# EAGLE design working (EAGLE 6.3)
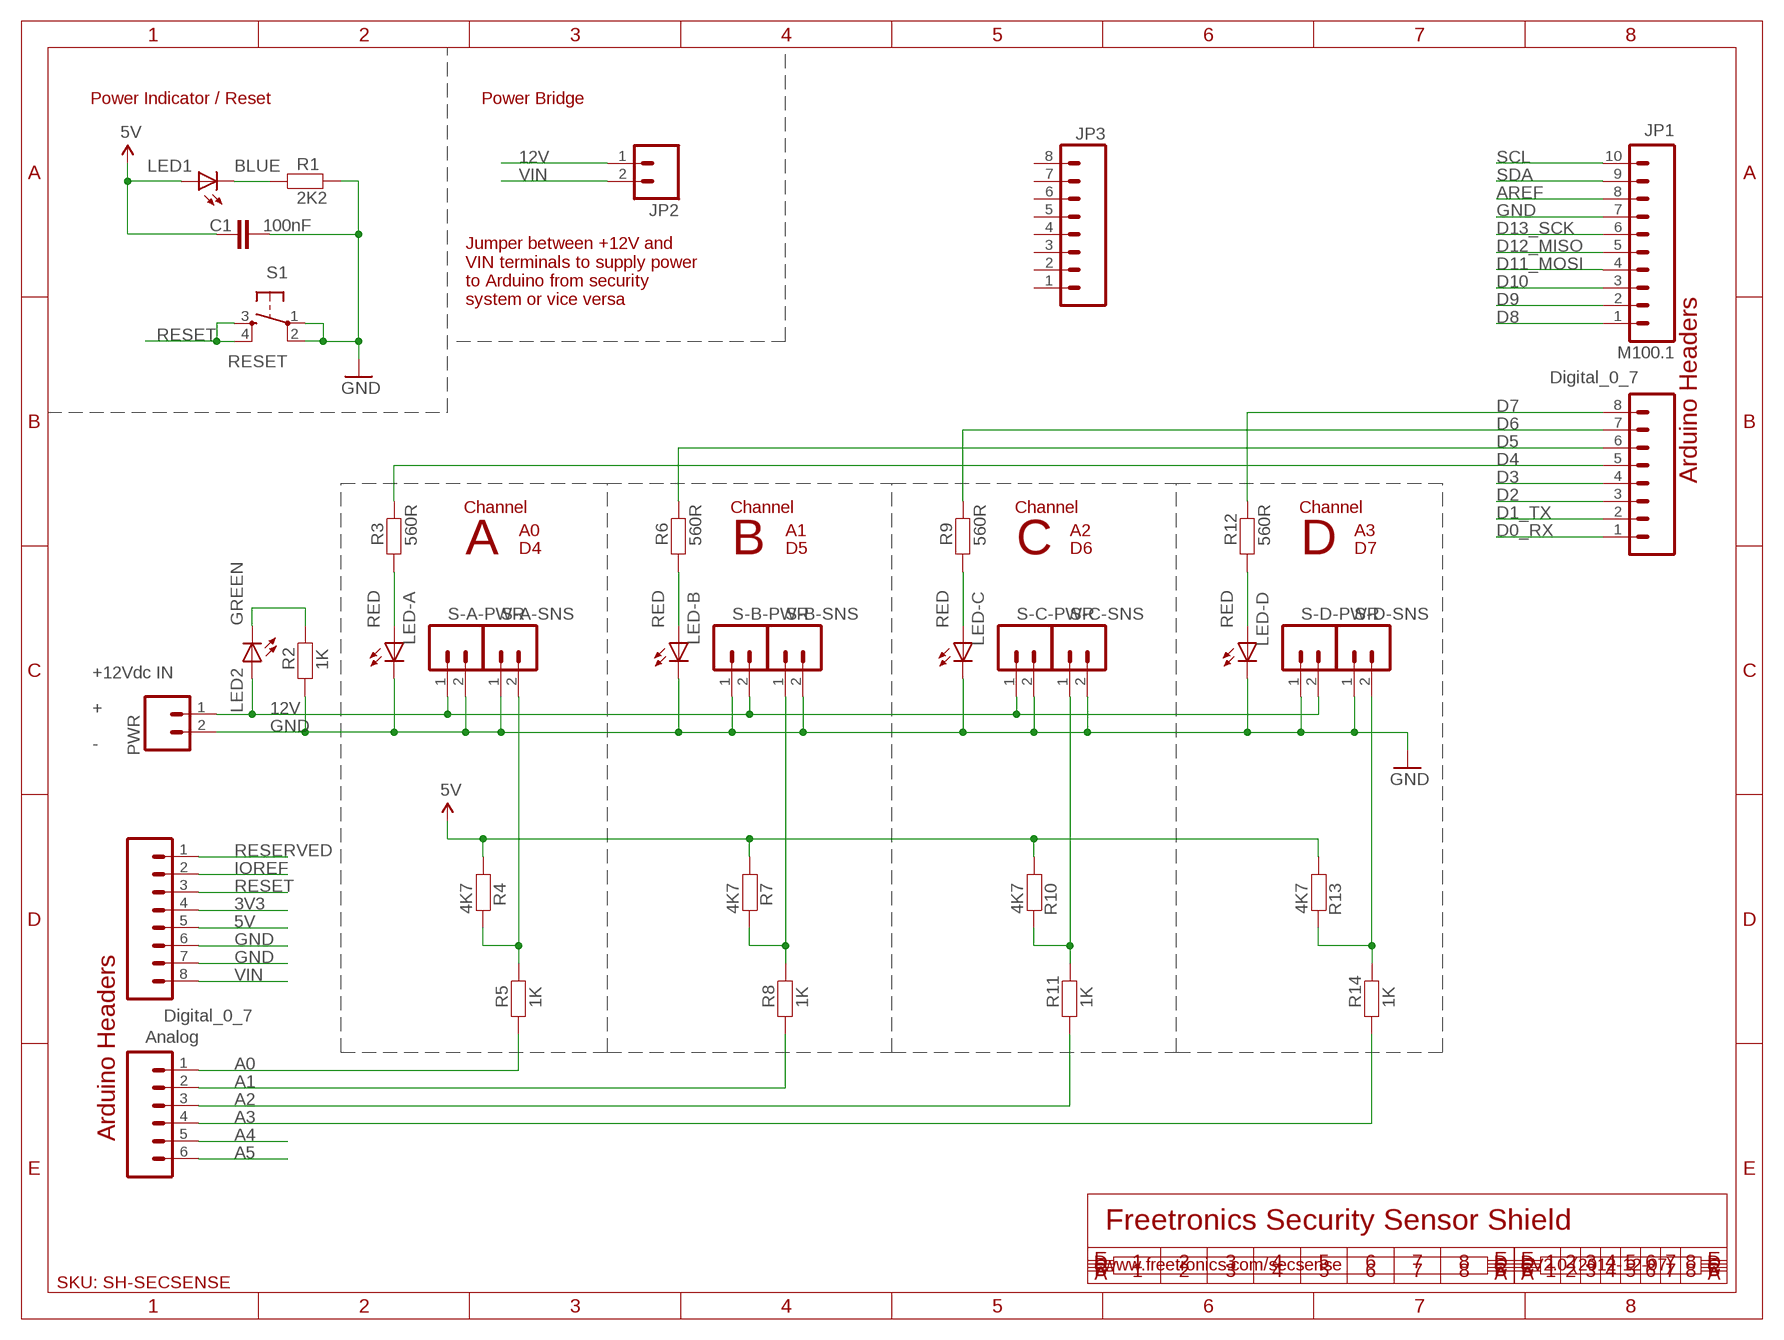
[diagram p0: schematic, sheet 1]

## Parts
C1  100nF  FREETRONICS_CAPPTH  [FREETRONICS_CAP-PTH-SMALL]
J1  Digital_0_7  M08  [1X08]
J2  Analog  M06SIP  [1X06]
J3  Digital_0_7  M08  [1X08]
JP1  M100.1  [1X10]
JP2  M02PTH  [1X02]
JP3  M08  [TERMINALBLOCK_3.5MM_8]
LED1  BLUE  LED3MM  [LED3MM]
LED2  GREEN  LED3MM  [LED3MM]
LED-A  RED  LED3MM  [LED3MM]
LED-B  RED  LED3MM  [LED3MM]
LED-C  RED  LED3MM  [LED3MM]
LED-D  RED  LED3MM  [LED3MM]
PWR  M025MM  [SCREWTERMINAL-5MM-2]
R1  2K2  FREETRONICS_RESISTORPTH2  [FREETRONICS_AXIAL-0.4]
R2  1K  FREETRONICS_RESISTORPTH2  [FREETRONICS_AXIAL-0.4]
R3  560R  FREETRONICS_RESISTORPTH2  [FREETRONICS_AXIAL-0.4]
R4  4K7  FREETRONICS_RESISTORPTH2  [FREETRONICS_AXIAL-0.4]
R5  1K  FREETRONICS_RESISTORPTH2  [FREETRONICS_AXIAL-0.4]
R6  560R  FREETRONICS_RESISTORPTH2  [FREETRONICS_AXIAL-0.4]
R7  4K7  FREETRONICS_RESISTORPTH2  [FREETRONICS_AXIAL-0.4]
R8  1K  FREETRONICS_RESISTORPTH2  [FREETRONICS_AXIAL-0.4]
R9  560R  FREETRONICS_RESISTORPTH2  [FREETRONICS_AXIAL-0.4]
R10  4K7  FREETRONICS_RESISTORPTH2  [FREETRONICS_AXIAL-0.4]
R11  1K  FREETRONICS_RESISTORPTH2  [FREETRONICS_AXIAL-0.4]
R12  560R  FREETRONICS_RESISTORPTH2  [FREETRONICS_AXIAL-0.4]
R13  4K7  FREETRONICS_RESISTORPTH2  [FREETRONICS_AXIAL-0.4]
R14  1K  FREETRONICS_RESISTORPTH2  [FREETRONICS_AXIAL-0.4]
S1  RESET  FREETRONICS_TAC_SWITCHPTH  [FREETRONICS_TACTILE-PTH]
S-A-PWR  M025MM  [SCREWTERMINAL-5MM-2]
S-A-SNS  M025MM  [SCREWTERMINAL-5MM-2]
S-B-PWR  M025MM  [SCREWTERMINAL-5MM-2]
S-B-SNS  M025MM  [SCREWTERMINAL-5MM-2]
S-C-PWR  M025MM  [SCREWTERMINAL-5MM-2]
S-C-SNS  M025MM  [SCREWTERMINAL-5MM-2]
S-D-PWR  M025MM  [SCREWTERMINAL-5MM-2]
S-D-SNS  M025MM  [SCREWTERMINAL-5MM-2]

## Nets
3V3: J3.4
5V: C1.1 J3.5 LED1.A R4.P$1 R7.P$1 R10.P$1 R13.P$1
12V: JP2.1 LED2.A PWR.1 S-A-PWR.1 S-B-PWR.2 S-C-PWR.1 S-D-PWR.2
A0: J2.1 R5.P$1
A1: J2.2 R8.P$1
A2: J2.3 R11.P$1
A3: J2.4 R14.P$1
A4: J2.5
A5: J2.6
AREF: JP1.8
D0_RX: J1.1
D1_TX: J1.2
D2: J1.3
D3: J1.4
D4: J1.5 R3.P$2
D5: J1.6 R6.P$2
D6: J1.7 R9.P$2
D7: J1.8 R12.P$2
D8: JP1.1
D9: JP1.2
D10: JP1.3
D11_MOSI: JP1.4
D12_MISO: JP1.5
D13_SCK: JP1.6
GND: C1.2 J3.6 J3.7 JP1.7 LED-A.K(C) LED-B.K(C) LED-C.K(C) LED-D.K(C) PWR.2 R1.P$2 R2.P$1 S1.1 S1.2 S-A-PWR.2 S-A-SNS.1 S-B-PWR.1 S-B-SNS.2 S-C-PWR.2 S-C-SNS.2 S-D-PWR.1 S-D-SNS.1
IOREF: J3.2
N$1: LED2.K(C) R2.P$2
N$3: R7.P$2 R8.P$2 S-B-SNS.1
N$248: LED1.K(C) R1.P$1
N$249: R10.P$2 R11.P$2 S-C-SNS.1
N$251: LED-D.A R12.P$1
N$252: LED-C.A R9.P$1
N$253: LED-B.A R6.P$1
N$254: LED-A.A R3.P$1
N$256: R13.P$2 R14.P$2 S-D-SNS.2
N$262: R4.P$2 R5.P$2 S-A-SNS.2
RESERVED: J3.1
RESET: J3.3 S1.3 S1.4
SCL: JP1.10
SDA: JP1.9
VIN: J3.8 JP2.2
Unconnected: JP3.1 JP3.2 JP3.3 JP3.4 JP3.5 JP3.6 JP3.7 JP3.8

## Notes on the sheet
- Power Indicator / Reset | Power Bridge
- Jumper between +12V and
  VIN terminals to supply power
  to Arduino from security
  system or vice versa
- Arduino Headers
- Channel | Channel | Channel | Channel
- A0 | A1 | A2 | A3
- A | D4 | B | D5 | C | D6 | D | D7
- +12Vdc IN
- +
- -
- Arduino Headers
- Freetronics Security Sensor Shield
- www.freetronics.com/secsense | V2.0 (2012-12-07)
- SKU: SH-SECSENSE

## Library data of the parts
C1 = freetronics:FREETRONICS_CAP: Capacitor Standard 0603 ceramic capacitor, and 0.1" leaded capacitor.
J1 J3 = freetronics:M08: Header 8 Standard 8-pin 0.1" header. Use with straight break away headers (SKU : PRT-00116), right angle break away headers (PRT-00553), swiss pins (PRT-00743), machine pins (PRT-00117), and female headers (PRT-00115).
J2 = freetronics:M06: Header 6 Standard 6-pin 0.1" header. Use with straight break away headers (SKU : PRT-00116), right angle break away headers (PRT-00553), swiss pins (PRT-00743), machine pins (PRT-00117), and female headers (PRT-00115). Molex polarized connector foot print use with SKU : PRT-08094 with associated crimp pins and housings. NOTES ON THE VARIANTS LOCK and LOCK_LONGPADS... This footprint was designed to help hold the alignment of a through-hole component (i.e. 6-pin header) while soldering it into place. You may notice that each hole has been shifted either up or down by 0.005 of an inch from it's more standard position (which is a perfectly straight line). This slight alteration caused the pins (the squares in the middle) to touch the edges of the holes. Because they are alternating, it causes a "brace" to hold the component in place. 0.005 has proven to be the perfect amount of "off-center" position when using our standard breakaway headers. Although looks a little odd when you look at the bare footprint, once you have a header in there, the alteration is very hard to notice. Also, if you push a header all the way into place, it is covered up entirely on the bottom side. This idea of altering the position of holes to aid alignment will be further integrated into the Sparkfun Library for other footprints. It can help hold any component with 3 or more connection pins.
JP1 = freetronics-original:M10: Header 10 Standard 10-pin 0.1" header. Use with straight break away headers (SKU : PRT-00116), right angle break away headers (PRT-00553), swiss pins (PRT-00743), machine pins (PRT-00117), and female headers (PRT-00115).
JP2 = freetronics-original:M02: Header 2 Standard 2-pin 0.1" header. Use with straight break away headers (SKU : PRT-00116), right angle break away headers (PRT-00553), swiss pins (PRT-00743), machine pins (PRT-00117), and female headers (PRT-00115). Molex polarized connector foot print use with SKU : PRT-08233 with associated crimp pins and housings.
JP3 = freetronics-master-v1:M08: Header 8 Standard 8-pin 0.1" header. Use with straight break away headers (SKU : PRT-00116), right angle break away headers (PRT-00553), swiss pins (PRT-00743), machine pins (PRT-00117), and female headers (PRT-00115).
LED1 LED2 LED-A LED-B LED-C LED-D = freetronics-master-v1:LED: LEDs Standard schematic elements and footprints for 5mm, 3mm, 1206, and 0603 sized LEDs. 5mm - Spark Fun Electronics SKU : COM-00529 (and others)
PWR S-A-PWR S-A-SNS S-B-PWR S-B-SNS S-C-PWR S-C-SNS S-D-PWR S-D-SNS = SparkFun:M02: Header 2 Standard 2-pin 0.1" header. Use with straight break away headers (SKU : PRT-00116), right angle break away headers (PRT-00553), swiss pins (PRT-00743), machine pins (PRT-00117), and female headers (PRT-00115). Molex polarized connector foot print use with SKU : PRT-08233 with associated crimp pins and housings.
R1-R14 = freetronics:FREETRONICS_RESISTOR: Resistor Basic schematic elements and footprints for 0603, 1206, and PTH 1/10th watt (small) resistors.
S1 = freetronics:FREETRONICS_TAC_SWITCH: Momentary Switch Button commonly used for reset or general input. Spark Fun Electronics SKU : COM-00097

## Board
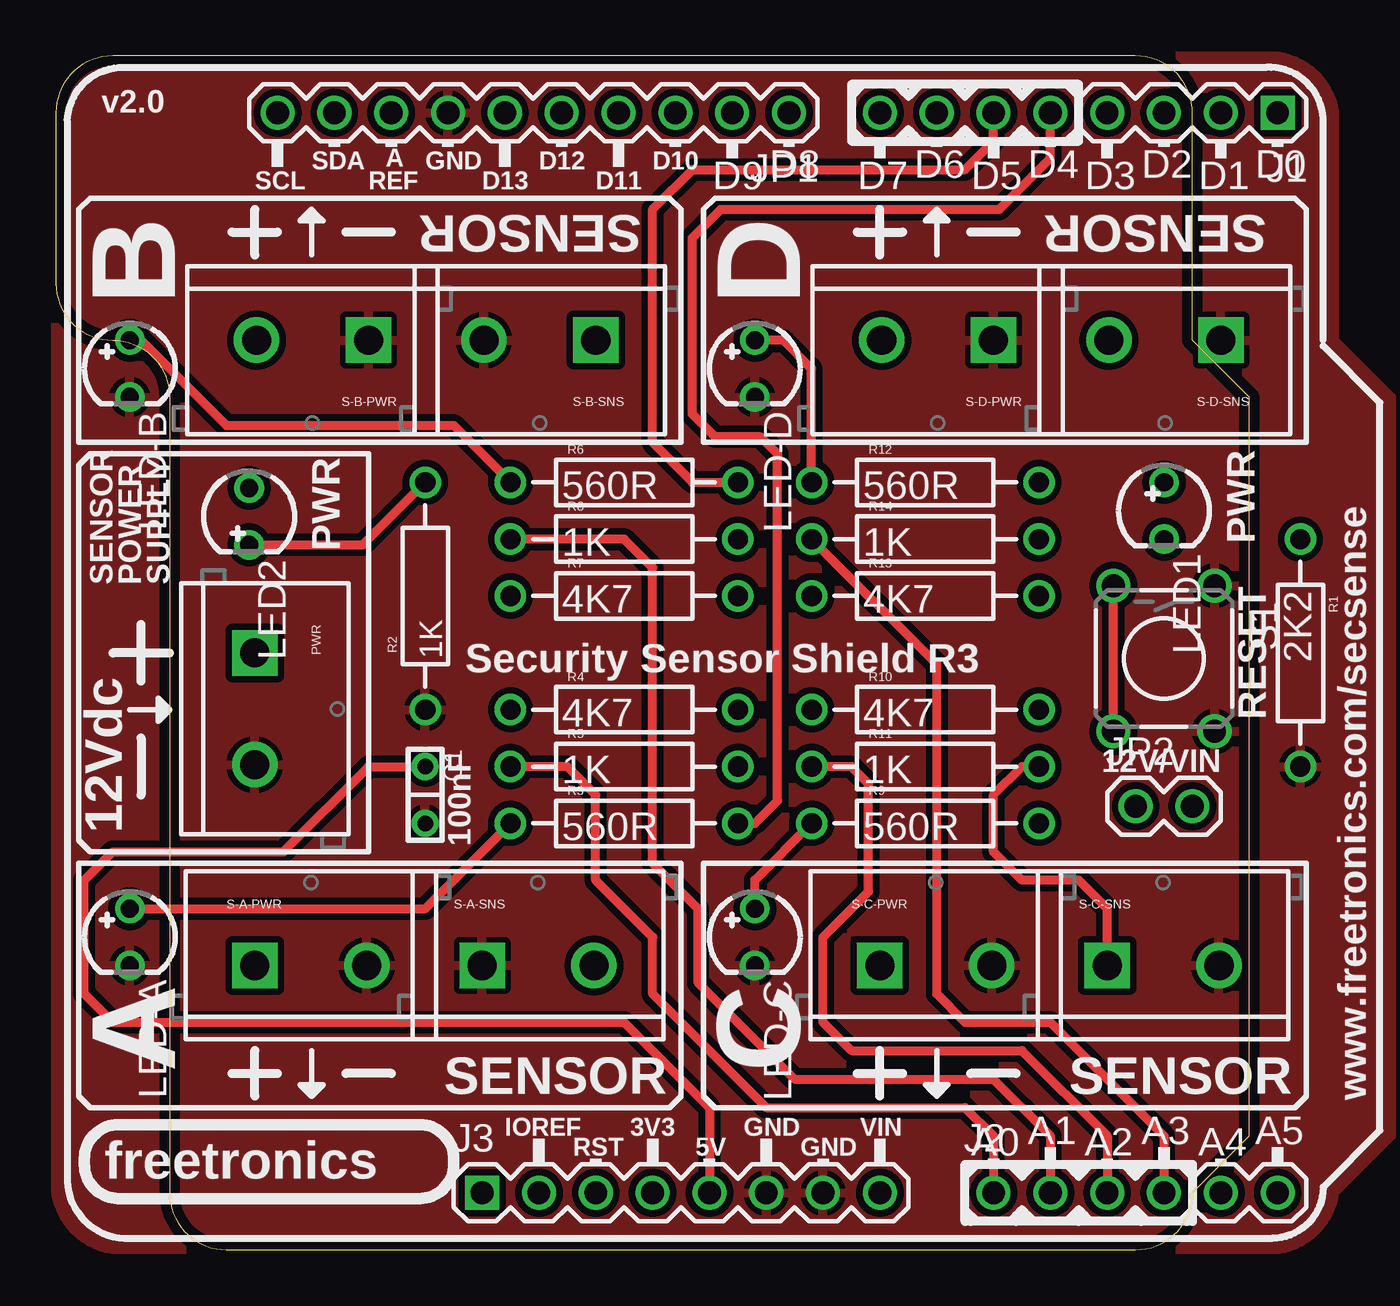
[diagram p1: board, top side]
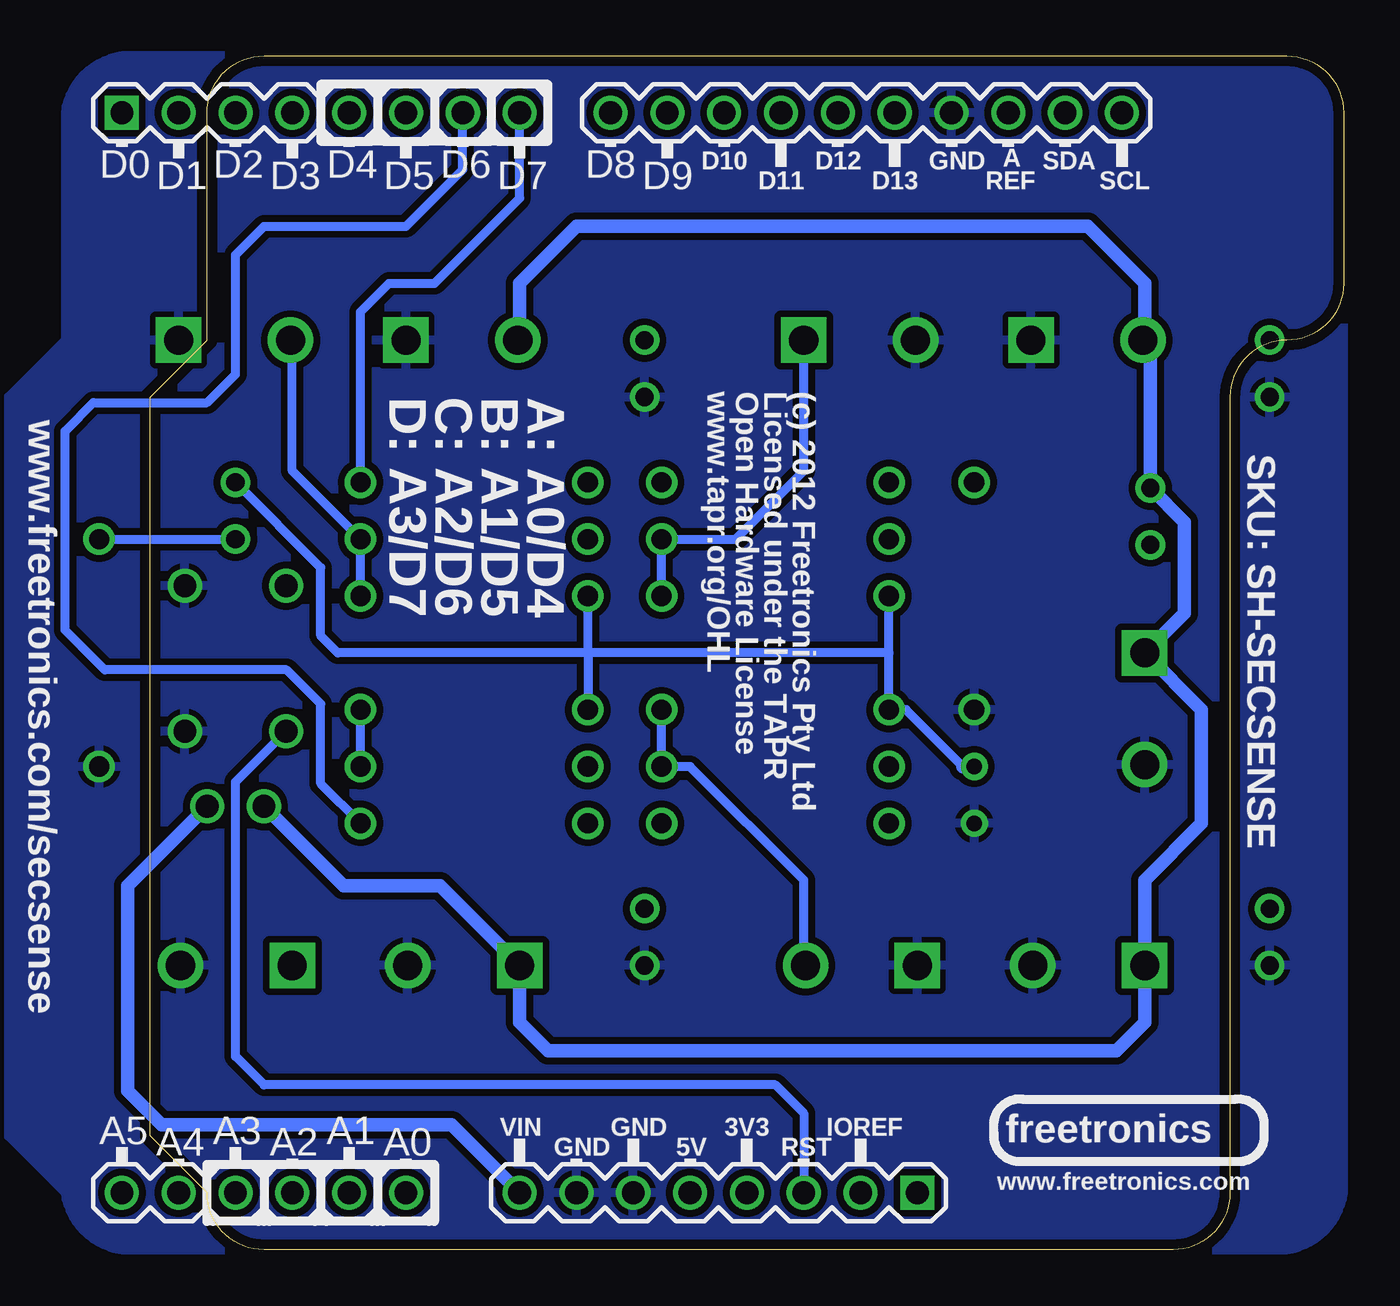
[diagram p2: board, bottom side, seen from below]

Size 53.34 x 53.34 mm. Coordinates in mm from the lower left corner, seen from the top.
Outline: 5.08,2.54 arc90 7.62,0 48.26,0 arc90 50.8,2.54 53.34,5.08 53.34,38.1 50.8,40.64 50.8,50.8 arc90 48.26,53.34 2.54,53.34 arc90 0,50.8 0,43.18 arc90 2.54,40.64 arc-90 5.08,38.1 5.08,2.54
Copper layers (1*16): Top 0.035mm / dielectric 1.5mm / Bottom 0.035mm
Design rules "default *": minimum track width 10mil, minimum drill 24mil, track to track 12mil, track to pad 12mil, pad to pad 12mil, via to via 12mil, smd to smd 8mil, copper to edge 18mil, drill to drill 8mil, minimum pad ring 10mil, minimum via ring 8mil, stop-mask expansion 4mil, vias tented up to drill 25mil, thermal gap 10mil

### Footprints (pad centres in the part's own frame; a part is rotated, then mirrored left to right if it is on the bottom)
FREETRONICS_CAP-PTH-SMALL = drill 0.7: 1 0,0; 2 2.54,0
1X08 = drill 1.016 square: 1 0,0 | drill 1.016: 2 2.54,0; 3 5.08,0; 4 7.62,0; 5 10.16,0; 6 12.7,0; 7 15.24,0; 8 17.78,0
1X06 = drill 1.016: 1 0,0; 2 2.54,0; 3 5.08,0; 4 7.62,0; 5 10.16,0; 6 12.7,0
1X10 = drill 1.016: 1 0,0; 2 2.54,0; 3 5.08,0; 4 7.62,0; 5 10.16,0; 6 12.7,0; 7 15.24,0; 8 17.78,0; 9 20.32,0; 10 22.86,0
1X02 = drill 1.016: 1 0,0; 2 2.54,0
TERMINALBLOCK_3.5MM_8 = drill 1.2 square: 1 0,0 | drill 1.2: 2 3.5,0; 3 7,0; 4 10.5,0; 5 14,0; 6 17.5,0; 7 21,0; 8 24.5,0
LED3MM = drill 0.813: A -1.27,0; K 1.27,0
SCREWTERMINAL-5MM-2 = drill 1.3 pad 2.032 square: 1 0,0 | drill 1.3 pad 2.032: 2 5,0
FREETRONICS_AXIAL-0.4 = drill 0.9: P$1 -5.08,0; P$2 5.08,0
FREETRONICS_TACTILE-PTH = drill 1.016: 1 -3.251,2.261; 2 3.251,2.261; 3 -3.251,-2.261; 4 3.251,-2.261

### Placement (x,y rotation side)
C1  16.51,21.59 270 top
J1  54.61,50.8 180 top
J2  41.91,2.54 0 top
J3  19.05,2.54 0 top
JP1  32.77,50.8 180 top
JP2  48.26,19.81 0 top
JP3  73.66,17.78 90 top  (outside the outline)
LED1  49.53,33.02 270 top
LED2  8.64,32.77 270 top
LED-A  3.3,13.97 270 top
LED-B  3.3,39.37 270 top
LED-C  31.24,13.97 270 top
LED-D  31.24,39.37 270 top
PWR  8.89,26.67 270 top
R1  55.63,26.67 270 top
R2  16.51,29.21 90 top
R3  25.4,19.05 0 top
R4  25.4,24.13 0 top
R5  25.4,21.59 0 top
R6  25.4,34.29 0 top
R7  25.4,29.21 0 top
R8  25.4,31.75 0 top
R9  38.86,19.05 0 top
R10  38.86,24.13 0 top
R11  38.86,21.59 0 top
R12  38.86,34.29 0 top
R13  38.86,29.21 0 top
R14  38.86,31.75 0 top
S1  49.53,26.42 270 top
S-A-PWR  8.89,12.7 0 top
S-A-SNS  19.05,12.7 0 top
S-B-PWR  13.97,40.64 180 top
S-B-SNS  24.13,40.64 180 top
S-C-PWR  36.83,12.7 0 top
S-C-SNS  46.99,12.7 0 top
S-D-PWR  41.91,40.64 180 top
S-D-SNS  52.07,40.64 180 top

### Tracks (layer width: path | path; a pad name or v marks a point on that pad's centre or on a via)
5V
  Top 0.406: C1.1 13.97,21.59 10.16,17.78 2.54,17.78 1.27,16.51 1.27,11.43 2.54,10.16 25.4,10.16 29.21,6.35 J3.5
  Bottom 0.406: 33.78,26.67 R10.P$1 | 33.78,26.67 R13.P$1 | 20.32,26.67 R4.P$1 19.56,24.13 17.02,21.59 | 20.32,26.67 R7.P$1 | 20.32,26.67 33.78,26.67 | 33.78,26.67 44.96,26.67 45.72,27.43 45.72,30.48 LED1.A
  Bottom 0.61: C1.1 17.02,21.59
12V
  Bottom 0.61: S-D-PWR.2 36.83,40.72 36.83,43.18 34.29,45.72 11.43,45.72 8.89,43.18 8.89,40.72 8.97,40.72 | JP2.1 44.7,16.26 40.39,16.26 S-C-PWR.1 36.83,10.16 35.56,8.89 10.16,8.89 8.89,10.16 S-A-PWR.1 8.89,16.51 6.35,19.05 6.35,24.13 PWR.1 7.11,28.45 7.11,32.51 LED2.A 8.64,40.31 S-B-PWR.2
  Bottom 0.813: S-B-PWR.2 8.97,40.72
A0
  Top 0.406: R5.P$1 22.86,21.59 24.13,20.32 24.13,16.51 26.67,13.97 26.67,11.43 31.75,6.35 40.64,6.35 41.91,5.08 J2.1
A1
  Top 0.406: J2.2 44.45,5.08 41.91,7.62 33.02,7.62 28.7,11.94 28.7,15.24 26.67,17.27 26.67,30.48 25.4,31.75 R8.P$1
A2
  Top 0.406: J2.3 46.99,5.08 43.18,8.89 35.56,8.89 34.29,10.16 34.29,13.97 36.32,16 36.32,20.83 35.56,21.59 R11.P$1
A3
  Top 0.406: J2.4 49.53,5.08 44.45,10.16 40.64,10.16 39.37,11.43 39.37,26.16 R14.P$1
D4
  Top 0.406: J1.5 44.45,48.77 42.16,46.48 29.72,46.48 28.45,45.21 28.45,37.34 29.46,36.32 31.5,36.32 32.26,35.56 32.26,20.07 31.24,19.05 R3.P$2
D5
  Top 0.406: J1.6 41.91,49.53 40.64,48.26 28.45,48.26 26.67,46.48 26.67,36.07 28.45,34.29 R6.P$2
D6
  Bottom 0.406: J1.7 39.37,48.26 41.91,45.72 48.26,45.72 49.53,44.45 49.53,39.12 50.8,37.85 55.88,37.85 57.15,36.58 57.15,27.69 55.37,25.91 47.24,25.91 45.72,24.38 45.72,20.83 R9.P$2
D7
  Bottom 0.406: J1.8 36.83,46.99 40.64,43.18 42.67,43.18 43.94,41.91 R12.P$2
GND
  pour Bottom: 0,50.8 arc-74 2.54,53.34 54.61,53.34 arc-74 57.15,50.8 57.15,40.64 59.69,38.1 59.69,5.08 57.15,2.54 arc-74 54.61,0 2.54,0 arc-74 0,2.54
  pour Top: 0,50.8 arc-74 2.54,53.34 54.61,53.34 arc-74 57.15,50.8 57.15,40.64 59.69,38.1 59.69,5.08 57.15,2.54 arc-74 54.61,0 2.54,0 arc-74 0,2.54
N$1
  Top 0.406: LED2.K 13.72,31.5 R2.P$2
N$3
  Bottom 0.406: R7.P$2 R8.P$2 27.18,31.75 24.13,34.8 S-B-SNS.1
N$248
  Bottom 0.406: R1.P$1 LED1.K
N$249
  Top 0.406: R11.P$2 43.18,21.59 41.91,20.32 41.91,17.78 43.18,16.51 45.72,16.51 46.99,15.24 S-C-SNS.1
  Bottom 0.406: R11.P$2 R10.P$2
N$251
  Top 0.406: R12.P$1 33.78,39.37 32.51,40.64 LED-D.A
N$252
  Top 0.406: R9.P$1 31.24,16.51 LED-C.A
N$253
  Top 0.406: R6.P$1 17.78,36.83 7.62,36.83 3.81,40.64 LED-B.A
N$254
  Top 0.406: LED-A.A 16.51,15.24 R3.P$1
N$256
  Bottom 0.406: R13.P$2 R14.P$2 46.99,34.8 46.99,40.56
  Bottom 0.61: 46.99,40.56 S-D-SNS.2
N$262
  Bottom 0.406: R4.P$2 R5.P$2 29.21,21.59 24.13,16.51 24.13,12.78 S-A-SNS.2
RESET
  Top 0.406: S1.4 S1.3
  Bottom 0.406: J3.3 24.13,6.1 25.4,7.37 48.26,7.37 49.53,8.64 49.53,20.9 S1.4
VIN
  Bottom 0.61: JP2.2 54.36,16.26 54.36,7.11 52.83,5.59 39.88,5.59 J3.8

### Text on the board
tPlace: v2.0 | SDA | A | GND | D12 | D10 | D8 | D6 | D4 | D2 | D0 | SCL | REF | D13 | D11 | D9 | D7 | D5 | D3 | D1 | SENSOR | SENSOR | B | D | PWR | PWR | SENSOR | POWER | SUPPLY | Security Sensor Shield R3 | RESET | 12V/VIN | 12Vdc | 100nF | A | C | SENSOR | SENSOR | www.freetronics.com/secsense | IOREF | 3V3 | GND | VIN | A1 | A3 | A5 | RST | 5V | GND | A0 | A2 | A4 | freetronics
bPlace: SDA | A | GND | D12 | D10 | D8 | D6 | D4 | D2 | D0 | SCL | REF | D13 | D11 | D9 | D7 | D5 | D3 | D1 | (c) 2012 Freetronics Pty Ltd | Licensed under the TAPR | Open Hardware License | www.tapr.org/OHL | A: A0/D4 / B: A1/D5 / C: A2/D6 / D: A3/D7 | www.freetronics.com/secsense | SKU: SH-SECSENSE | freetronics | IOREF | 3V3 | GND | VIN | A1 | A3 | A5 | RST | 5V | GND | A0 | A2 | A4 | www.freetronics.com